# Altium schematic sheet A7_JTAG&CONFIG.SchDoc
size A3
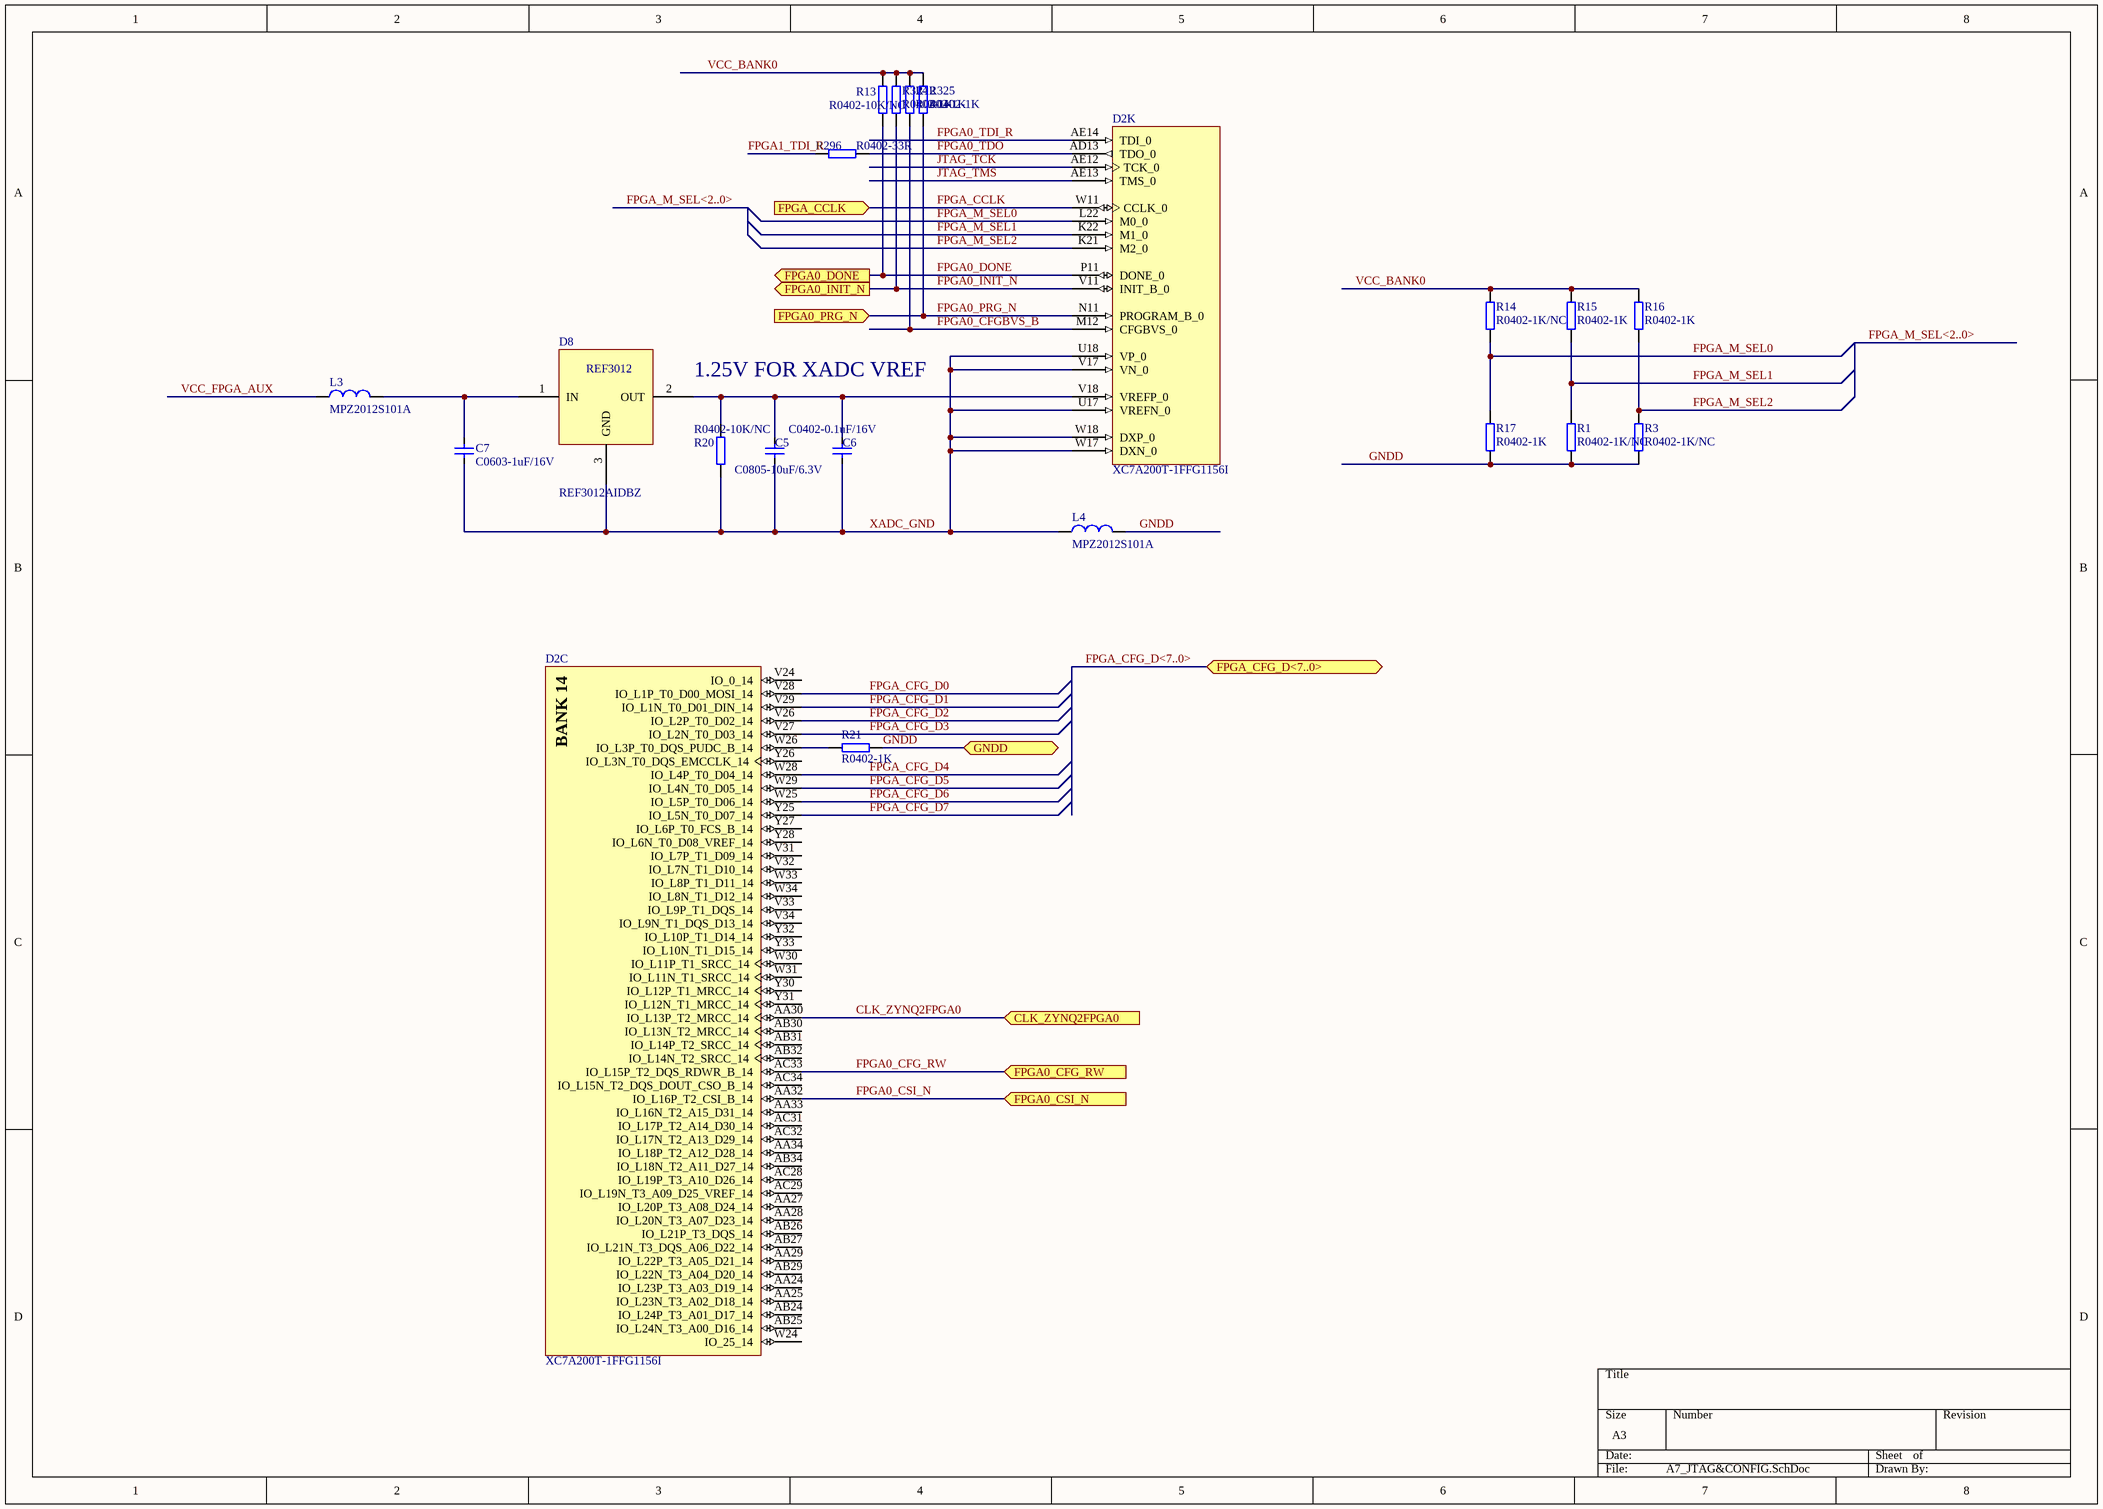
[diagram p0: A7_JTAG&CONFIG.SchDoc]

## Parts
C5  C0805-10uF/6.3V  [C0805]
C6  C0402-0.1uF/16V  [C0402]
C7  C0603-1uF/16V  [C0603]
D2  XC7A200T-1FFG1156I  [FFG1156]  (parts C,K of 18)
D8  REF3012AIDBZ  [SOT-23]
L3  MPZ2012S101A  [R0805]
L4  MPZ2012S101A  [R0805]
R1  R0402-1K/NC  [R0402]
R3  R0402-1K/NC  [R0402]
R12  R0402-1K  [R0402]
R13  R0402-10K/NC  [R0402]
R14  R0402-1K/NC  [R0402]
R15  R0402-1K  [R0402]
R16  R0402-1K  [R0402]
R17  R0402-1K  [R0402]
R20  R0402-10K/NC  [R0402]
R21  R0402-1K  [R0402]
R296  R0402-33R  [R0402]
R324  R0402-1K  [R0402]
R325  R0402-1K  [R0402]

## Ports
CLK_ZYNQ2FPGA0 (in), FPGA0_CFG_RW (in), FPGA0_CSI_N (in), FPGA0_DONE (out), FPGA0_INIT_N (out), FPGA0_PRG_N (in), FPGA_CCLK (in), FPGA_CFG_D<7..0>, GNDD

## Nets
CLK_ZYNQ2FPGA0: D2.AA30(IO_L13P_T2_MRCC_14) ; port CLK_ZYNQ2FPGA0
FPGA0_CFG_RW: D2.AC33(IO_L15P_T2_DQS_RDWR_B_14) ; port FPGA0_CFG_RW
FPGA0_CFGBVS_B: D2.M12(CFGBVS_0) R12.1
FPGA0_CSI_N: D2.AA32(IO_L16P_T2_CSI_B_14) ; port FPGA0_CSI_N
FPGA0_DONE: D2.P11(DONE_0) R13.1 ; port FPGA0_DONE
FPGA0_INIT_N: D2.V11(INIT_B_0) R324.1 ; port FPGA0_INIT_N
FPGA0_PRG_N: D2.N11(PROGRAM_B_0) R325.1 ; port FPGA0_PRG_N
FPGA0_TDI_R: D2.AE14(TDI_0)
FPGA0_TDO: D2.AD13(TDO_0) R296.2
FPGA1_TDI_R: R296.1
FPGA_CCLK: D2.W11(CCLK_0) ; port FPGA_CCLK
FPGA_CFG_D0: D2.V28(IO_L1P_T0_D00_MOSI_14)
FPGA_CFG_D1: D2.V29(IO_L1N_T0_D01_DIN_14)
FPGA_CFG_D2: D2.V26(IO_L2P_T0_D02_14)
FPGA_CFG_D3: D2.V27(IO_L2N_T0_D03_14)
FPGA_CFG_D4: D2.W28(IO_L4P_T0_D04_14)
FPGA_CFG_D5: D2.W29(IO_L4N_T0_D05_14)
FPGA_CFG_D6: D2.W25(IO_L5P_T0_D06_14)
FPGA_CFG_D7: D2.Y25(IO_L5N_T0_D07_14)
FPGA_M_SEL0: D2.L22(M0_0) R14.1 R17.2
FPGA_M_SEL1: D2.K22(M1_0) R1.2 R15.1
FPGA_M_SEL2: D2.K21(M2_0) R3.2 R16.1
GNDD: L4.2 R1.1 R3.1 R17.1 R21.1 ; port GNDD
JTAG_TCK: D2.AE12(TCK_0)
JTAG_TMS: D2.AE13(TMS_0)
VCC_BANK0: R12.2 R13.2 R14.2 R15.2 R16.2 R324.2 R325.2
VCC_FPGA_AUX: L3.1
XADC_GND: C5.2 C6.2 C7.2 D2.U17(VREFN_0) D2.U18(VP_0) D2.V17(VN_0) D2.W17(DXN_0) D2.W18(DXP_0) D8.3(GND) L4.1 R20.2
NetC5_1: C5.1 C6.1 D2.V18(VREFP_0) D8.2(OUT) R20.1
NetC7_1: C7.1 D8.1(IN) L3.2
NetD2_W26: D2.W26(IO_L3P_T0_DQS_PUDC_B_14) R21.2

Not connected (* = marked no-connect by the designer): D2 AA24(IO_L23P_T3_A03_D19_14) AA25(IO_L23N_T3_A02_D18_14) AA27(IO_L20P_T3_A08_D24_14) AA28(IO_L20N_T3_A07_D23_14) AA29(IO_L22P_T3_A05_D21_14) AA33(IO_L16N_T2_A15_D31_14) AA34(IO_L18P_T2_A12_D28_14) AB24(IO_L24P_T3_A01_D17_14) AB25(IO_L24N_T3_A00_D16_14) AB26(IO_L21P_T3_DQS_14) AB27(IO_L21N_T3_DQS_A06_D22_14) AB29(IO_L22N_T3_A04_D20_14) AB30(IO_L13N_T2_MRCC_14) AB31(IO_L14P_T2_SRCC_14) AB32(IO_L14N_T2_SRCC_14) AB34(IO_L18N_T2_A11_D27_14) AC28(IO_L19P_T3_A10_D26_14) AC29(IO_L19N_T3_A09_D25_VREF_14) AC31(IO_L17P_T2_A14_D30_14) AC32(IO_L17N_T2_A13_D29_14) AC34(IO_L15N_T2_DQS_DOUT_CSO_B_14) V24(IO_0_14) V31(IO_L7P_T1_D09_14) V32(IO_L7N_T1_D10_14) V33(IO_L9P_T1_DQS_14) V34(IO_L9N_T1_DQS_D13_14) W24(IO_25_14) W30(IO_L11P_T1_SRCC_14) W31(IO_L11N_T1_SRCC_14) W33(IO_L8P_T1_D11_14) W34(IO_L8N_T1_D12_14) Y26(IO_L3N_T0_DQS_EMCCLK_14) Y27(IO_L6P_T0_FCS_B_14) Y28(IO_L6N_T0_D08_VREF_14) Y30(IO_L12P_T1_MRCC_14) Y31(IO_L12N_T1_MRCC_14) Y32(IO_L10P_T1_D14_14) Y33(IO_L10N_T1_D15_14)

## Buses and harness runs
bus FPGA_CFG_D<7..0> = port FPGA_CFG_D<7..0>
bus FPGA_M_SEL<2..0>

## Notes on the sheet
- 1.25V FOR XADC VREF
- (in symbol XC7A200T-1FFG1156I, part C) BANK 14

## Library data of the parts
C5 = C1210-22uF/16V: Part_number: C0805-10uF/6.3V; Part_type: CAP; Value: C0805-10uF/6.3V; Schematic_Part: CAP; PCB_Footprint: C0805
C6 = C0402-0.1uF/16V: X7R; Manufacturer: SAMSUNG; Manufacturer_p/n: CL05X7R104KO5NNN; Part_number: C0402-0.1uF/16V; Part_type: CAP; Value: C0402-0.1uF/16V; temperature: -55℃\+125℃; Schematic_Part: CAP; PCB_Footprint: C0402; datasheet: #DataSheet\C_Samsung_General Capacitors.pdf#
C7 = C0603-100nF/16V: X7R; Part_number: C0603-1uF/16V; Part_type: CAP; Value: C0603-1uF/16V; temperature: -55℃\+125℃; Schematic_Part: CAP; PCB_Footprint: C0603
D2 = XC7A200T-1FFG1156I: Artix-7 FPGA, 500 User I/Os, 16 GTP, 1156-Ball BGA, Speed Grade 1, Industrial Grade, Pb-Free; Manufacturer: Xilinx; Block RAM Blocks (18Kb): 730; Block RAM Blocks (36Kb): 365; Block RAM Blocks (Max Kb): 13140; CLBs (Slices): 33650; Clock Mgmt Tiles (CMTs): 10; DSP48E1 Slices: 740; Logic Cells: 215360; Max User I/O: 500; Speed Grade: -1; DatasheetVersion: v1.12; PackageVersion: Rev 1.8; PackageReference: FFG1156; PackageDescription: Flip-Chip BGA, Body 35 x 35 mm, 1.0 mm Pitch; CLBs (Max Distributed RAM Kb): 2888; Generic Part Number: XC7A200T; RoHS: Pb-Free; Mounting Technology: Surface Mount; Code_JEDEC: MS-034-AAR-1; PartNumber: XC7A200T-1FFG1156I; ComponentLink1Description: Datasheet; ComponentLink1URL: http://www.xilinx.com/support/documentation/data_sheets/ds180_7Series_Overview.pdf; ComponentLink2Description: Package Specification; ComponentLink2URL: http://www.xilinx.com/support/documentation/user_guides/ug475_7Series_Pkg_Pinout.pdf; ComponentLink3Description: DC and Switching Characteristics; ComponentLink3URL: http://www.xilinx.com/support/documentation/data_sheets/ds181_Artix_7_Data_Sheet.pdf; ComponentLink4Description: Package File; ComponentLink4URL: http://www.xilinx.com/support/packagefiles/a7packages/xc7a200tfbg676pkg.txt; ComponentLink5Description: Packaging and Pinout; ComponentLink5URL: http://www.xilinx.com/support/documentation/user_guides/ug475_7Series_Pkg_Pinout.pdf
L3 L4 = FB0805-330R@100MHz: Manufacturer: TDK; Part_number: MPZ2012S101A; Part_type: BEAD; temperature: -55℃\+125℃; Value1: 330R@100MHz; Schematic_Part: BEAD; PCB_Footprint: R0805; Manufacturer_p/n: MPZ2012S101A
R1 R3 R12-R17 R20 R21 R296 R324 R325 = R0402-10K: Manufacturer: SAMSUNG; Part_type: RES; Schematic_Part: RES; PCB_Footprint: R0402
  R1 R3 R14: Part_number: R0402-1K/NC; Value: R0402-1K/NC
  R12 R15-R17 R21 R324 R325: Part_number: R0402-1K; Value: R0402-1K
  R13 R20: Part_number: R0402-10K/NC; Value: R0402-10K/NC
  R296: Part_number: R0402-33R; Value: R0402-33R
D8 = REF3012AIDBZ: Part_number: REF3012AIDBZ